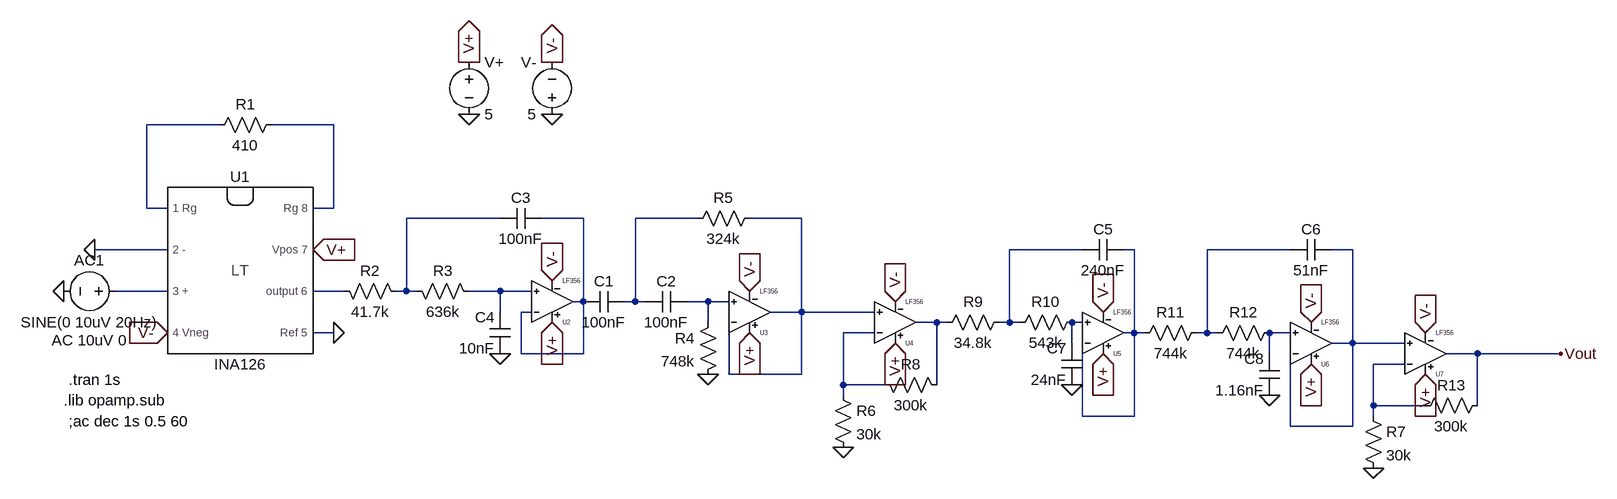
[diagram p0: schematic latest_amplifier.asc]
latest_amplifier.asc, the LTspice schematic file:
Version 4
SHEET 1 3012 680
WIRE 16 -32 -96 -32
WIRE 192 -32 96 -32
WIRE -96 96 -96 -32
WIRE -64 96 -96 96
WIRE 192 96 192 -32
WIRE 192 96 160 96
WIRE 448 112 304 112
WIRE 576 112 512 112
WIRE 752 112 656 112
WIRE 912 112 832 112
WIRE -64 160 -176 160
WIRE 1344 160 1232 160
WIRE 1424 160 1408 160
WIRE 1664 160 1536 160
WIRE 1760 160 1728 160
WIRE -64 224 -144 224
WIRE 208 224 160 224
WIRE 304 224 304 112
WIRE 304 224 288 224
WIRE 320 224 304 224
WIRE 448 224 400 224
WIRE 496 224 448 224
WIRE 576 240 576 112
WIRE 576 240 560 240
WIRE 656 240 656 112
WIRE 656 240 640 240
WIRE 672 240 656 240
WIRE 768 240 736 240
WIRE 800 240 768 240
WIRE 448 256 448 224
WIRE 496 256 480 256
WIRE 912 256 912 112
WIRE 912 256 864 256
WIRE 1024 256 912 256
WIRE 768 272 768 240
WIRE 1120 272 1088 272
WIRE 1136 272 1120 272
WIRE 1232 272 1232 160
WIRE 1232 272 1216 272
WIRE 1248 272 1232 272
WIRE 1344 272 1328 272
WIRE 192 288 160 288
WIRE 1024 288 976 288
WIRE 1424 288 1424 160
WIRE 1424 288 1408 288
WIRE 1440 288 1424 288
WIRE 1536 288 1536 160
WIRE 1536 288 1520 288
WIRE 1552 288 1536 288
WIRE 1664 288 1632 288
WIRE 1328 304 1328 272
WIRE 1760 304 1760 160
WIRE 1760 304 1728 304
WIRE 1840 304 1760 304
WIRE 480 320 480 256
WIRE 576 320 576 240
WIRE 576 320 480 320
WIRE 1632 320 1632 288
WIRE 1952 320 1904 320
WIRE 2080 320 1952 320
WIRE 1840 336 1792 336
WIRE 800 352 800 272
WIRE 912 352 912 256
WIRE 912 352 800 352
WIRE 976 368 976 288
WIRE 1040 368 976 368
WIRE 1120 368 1120 272
WIRE 976 384 976 368
WIRE 1792 400 1792 336
WIRE 1872 400 1792 400
WIRE 1952 400 1952 320
WIRE 1344 416 1344 304
WIRE 1424 416 1424 288
WIRE 1424 416 1344 416
WIRE 1792 416 1792 400
WIRE 1664 432 1664 320
WIRE 1760 432 1760 304
WIRE 1760 432 1664 432
FLAG 192 288 0
FLAG -176 160 0
FLAG -224 224 0
FLAG 400 -48 0
FLAG 528 -48 0
FLAG 400 -128 V+
IOPIN 400 -128 Out
FLAG 528 -128 V-
IOPIN 528 -128 Out
FLAG 160 160 V+
IOPIN 160 160 In
FLAG -64 288 V-
IOPIN -64 288 In
FLAG 768 352 0
FLAG 448 320 0
FLAG 1328 368 0
FLAG 1632 384 0
FLAG 976 464 0
FLAG 1792 496 0
FLAG 528 272 V+
IOPIN 528 272 In
FLAG 832 288 V+
IOPIN 832 288 In
FLAG 1376 320 V+
IOPIN 1376 320 In
FLAG 1056 304 V+
IOPIN 1056 304 In
FLAG 1696 336 V+
IOPIN 1696 336 In
FLAG 1872 352 V+
IOPIN 1872 352 In
FLAG 528 208 V-
IOPIN 528 208 In
FLAG 832 224 V-
IOPIN 832 224 In
FLAG 1056 240 V-
IOPIN 1056 240 In
FLAG 1376 256 V-
IOPIN 1376 256 In
FLAG 1696 272 V-
IOPIN 1696 272 In
FLAG 1872 288 V-
IOPIN 1872 288 In
FLAG 2080 320 Vout
SYMBOL INA126 48 192 R0
SYMATTR InstName U1
SYMBOL res 112 -48 R90
WINDOW 0 0 56 VBottom 2
WINDOW 3 32 56 VTop 2
SYMATTR InstName R1
SYMATTR Value 410
SYMBOL voltage -128 224 R90
WINDOW 0 -32 56 VBottom 2
WINDOW 3 32 56 VTop 2
WINDOW 123 60 56 VTop 2
WINDOW 39 0 0 Left 0
SYMATTR InstName AC1
SYMATTR Value SINE(0 10uV 20Hz)
SYMATTR Value2 AC 10uV 0
SYMBOL voltage 400 -144 R0
SYMATTR InstName V+
SYMATTR Value 5
SYMBOL voltage 528 -32 R180
WINDOW 0 24 96 Left 2
WINDOW 3 24 16 Left 2
SYMATTR InstName V-
SYMATTR Value 5
SYMBOL res 192 208 M90
WINDOW 0 0 56 VBottom 2
WINDOW 3 32 56 VTop 2
SYMATTR InstName R2
SYMATTR Value 41.7k
SYMBOL res 304 208 M90
WINDOW 0 0 56 VBottom 2
WINDOW 3 32 56 VTop 2
SYMATTR InstName R3
SYMATTR Value 636k
SYMBOL LF356 528 304 M180
SYMATTR InstName U2
SYMBOL LF356 832 320 M180
SYMATTR InstName U3
SYMBOL LF356 1056 336 M180
SYMATTR InstName U4
SYMBOL LF356 1376 352 M180
SYMATTR InstName U5
SYMBOL LF356 1696 368 M180
SYMATTR InstName U6
SYMBOL LF356 1872 384 M180
SYMATTR InstName U7
SYMBOL cap 640 224 R90
WINDOW 0 0 32 VBottom 2
WINDOW 3 32 32 VTop 2
SYMATTR InstName C1
SYMATTR Value 100nF
SYMBOL cap 736 224 R90
WINDOW 0 0 32 VBottom 2
WINDOW 3 32 32 VTop 2
SYMATTR InstName C2
SYMATTR Value 100nF
SYMBOL cap 512 96 R90
WINDOW 0 0 32 VBottom 2
WINDOW 3 32 32 VTop 2
SYMATTR InstName C3
SYMATTR Value 100nF
SYMBOL cap 464 320 R180
WINDOW 0 24 56 Left 2
WINDOW 3 24 8 Left 2
SYMATTR InstName C4
SYMATTR Value 10nF
SYMBOL res 784 256 M0
SYMATTR InstName R4
SYMATTR Value 748k
SYMBOL res 848 96 R90
WINDOW 0 0 56 VBottom 2
WINDOW 3 32 56 VTop 2
SYMATTR InstName R5
SYMATTR Value 324k
SYMBOL res 960 368 R0
SYMATTR InstName R6
SYMATTR Value 30k
SYMBOL res 1776 400 R0
SYMATTR InstName R7
SYMATTR Value 30k
SYMBOL res 1024 352 M90
WINDOW 0 0 56 VBottom 2
WINDOW 3 32 56 VTop 2
SYMATTR InstName R8
SYMATTR Value 300k
SYMBOL res 1232 256 R90
WINDOW 0 0 56 VBottom 2
WINDOW 3 32 56 VTop 2
SYMATTR InstName R9
SYMATTR Value 34.8k
SYMBOL res 1344 256 R90
WINDOW 0 0 56 VBottom 2
WINDOW 3 32 56 VTop 2
SYMATTR InstName R10
SYMATTR Value 543k
SYMBOL res 1536 272 R90
WINDOW 0 0 56 VBottom 2
WINDOW 3 32 56 VTop 2
SYMATTR InstName R11
SYMATTR Value 744k
SYMBOL res 1648 272 R90
WINDOW 0 0 56 VBottom 2
WINDOW 3 32 56 VTop 2
SYMATTR InstName R12
SYMATTR Value 744k
SYMBOL cap 1408 144 R90
WINDOW 0 0 32 VBottom 2
WINDOW 3 32 32 VTop 2
SYMATTR InstName C5
SYMATTR Value 240nF
SYMBOL cap 1728 144 R90
WINDOW 0 0 32 VBottom 2
WINDOW 3 32 32 VTop 2
SYMATTR InstName C6
SYMATTR Value 51nF
SYMBOL cap 1344 304 M0
SYMATTR InstName C7
SYMATTR Value 24nF
SYMBOL cap 1648 320 M0
SYMATTR InstName C8
SYMATTR Value 1.16nF
SYMBOL res 1968 384 R90
WINDOW 0 0 56 VBottom 2
WINDOW 3 32 56 VTop 2
SYMATTR InstName R13
SYMATTR Value 300k
TEXT -224 392 Left 2 !.lib opamp.sub
TEXT -216 360 Left 2 !.tran 1s
TEXT -216 424 Left 2 !;ac dec 1s 0.5 60

The netlist it stands for:
* latest_amplifier.asc
XU1 N001 0 N011 V- 0 N012 V+ N002 INA126  ; pins 1_Rg 2_- 3_+ 4_Vneg Ref_5 output_6 Vpos_7 Rg_8
R1 N002 N001 410
V§AC1 N011 0 SINE(0 10uV 20Hz) AC 10uV 0
V+ V+ 0 5
V- 0 V- 5
R2 N012 N003 41.7k
R3 N003 N013 636k
XU2 N013 N004 V+ V- N004 LF356  ; pins In+ In- V+ V- OUT
XU3 N014 N006 V+ V- N006 LF356  ; pins In+ In- V+ V- OUT
XU4 N006 N017 V+ V- N015 LF356  ; pins In+ In- V+ V- OUT
XU5 N016 N008 V+ V- N008 LF356  ; pins In+ In- V+ V- OUT
XU6 N018 N010 V+ V- N010 LF356  ; pins In+ In- V+ V- OUT
XU7 N010 N019 V+ V- Vout LF356  ; pins In+ In- V+ V- OUT
C1 N005 N004 100nF
C2 N014 N005 100nF
C3 N004 N003 100nF
C4 0 N013 10nF
R4 N014 0 748k
R5 N006 N005 324k
R6 N017 0 30k
R7 N019 0 30k
R8 N017 N015 300k
R9 N007 N015 34.8k
R10 N016 N007 543k
R11 N009 N008 744k
R12 N018 N009 744k
C5 N008 N007 240nF
C6 N010 N009 51nF
C7 N016 0 24nF
C8 N018 0 1.16nF
R13 Vout N019 300k
.lib opamp.sub
.tran 1s
;ac dec 1s 0.5 60
.lib INA126.sub
.lib LF356.sub
.backanno
.end